# Altium schematic sheet KeyBoard.SchDoc
size A4
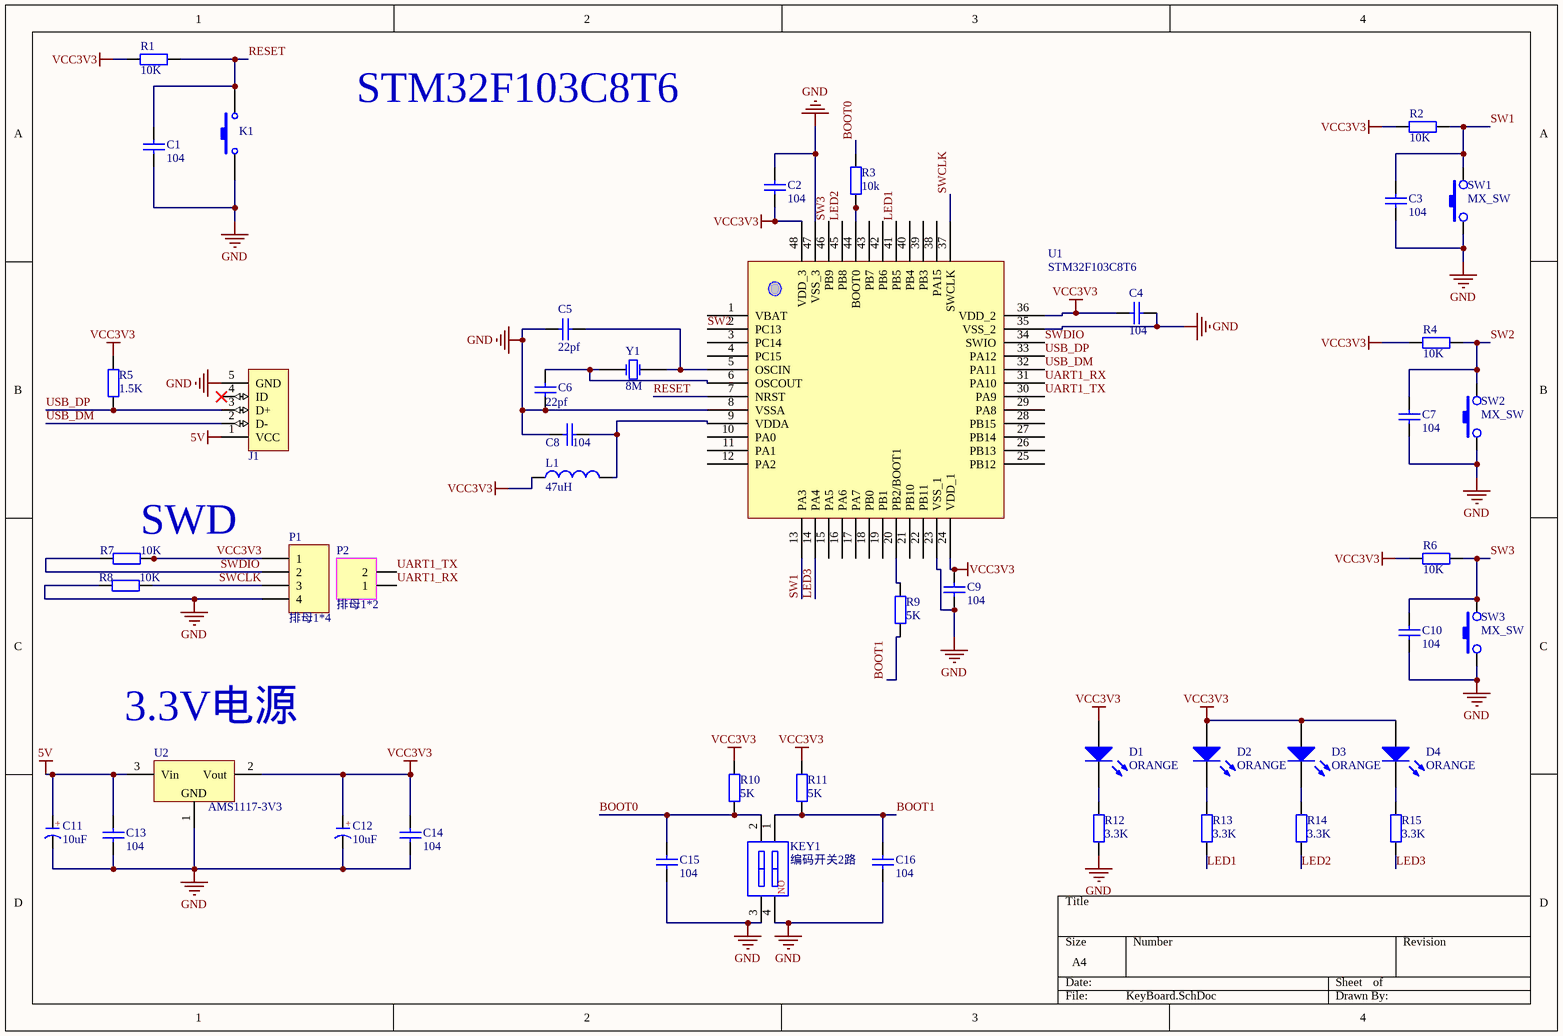
[diagram p0: KeyBoard.SchDoc]

## Parts
C1  104  [C 0805]
C2  104  [C 0805]
C3  104  [C 0805]
C4  104  [C 0805]
C5  22pf  [C 0805]
C6  22pf  [C 0805]
C7  104  [C 0805]
C8  104  [C 0805]
C9  104  [C 0805]
C10  104  [C 0805]
C11  10uF  [CD B(3528)]
C12  10uF  [CD B(3528)]
C13  104  [C 0805]
C14  104  [C 0805]
C15  104  [C 0805]
C16  104  [C 0805]
D1  ORANGE  [LED_0805]
D2  ORANGE  [LED_0805]
D3  ORANGE  [LED_0805]
D4  ORANGE  [LED_0805]
J1  Micro USB 2.0 PORT  [USB_MICRO]  (value not drawn)
K1  Key  [KEY 3.6*2.5 SMD]  (value not drawn)
KEY1  编码开关2路  [CSW1.27 SMD-2P]
L1  47uH  [L 0805]
P1  排母1*4  [HDR2.54-M-LI-4P]
P2  排母1*2  [HDR2.54-M-LI-2P]
R1  10K  [R 0805]
R2  10K  [R 0805]
R3  10k  [R 0805]
R4  10K  [R 0805]
R5  1.5K  [R 0805]
R6  10K  [R 0805]
R7  10K  [R 0805]
R8  10K  [R 0805]
R9  5K  [R 0805]
R10  5K  [R 0805]
R11  5K  [R 0805]
R12  3.3K  [R 0805]
R13  3.3K  [R 0805]
R14  3.3K  [R 0805]
R15  3.3K  [R 0805]
SW1  MX_SW  [MX_SW-4]
SW2  MX_SW  [MX_SW-4]
SW3  MX_SW  [MX_SW-4]
U1  STM32F103C8T6  [LQFP48]
U2  AMS1117-3V3  [SOT223_N]
Y1  8M  [XTAL-5032]

## Nets
5V: C11.1(A) C13.2 J1.1(VCC) U2.3(Vin)
GND: C1.1 C2.2 C3.1 C4.1 C5.2 C6.2 C7.1 C8.2 C9.1 C10.1 C11.2(K) C12.2(K) C13.1 C14.1 C15.1 C16.1 J1.5(GND) K1.1 KEY1.3 KEY1.4 P1.4 R8.2 R12.1 SW1.1 SW2.1 SW3.1 U1.8(VSSA) U1.23(VSS_1) U1.35(VSS_2) U1.47(VSS_3) U2.1(GND)
VCC3V3: C2.1 C4.2 C9.2 C12.1(A) C14.2 D1.1(A) D2.1(A) D3.1(A) D4.1(A) L1.1 P1.1 R1.1 R2.1 R4.1 R5.2 R6.1 R7.1 R10.2 R11.2 U1.24(VDD_1) U1.36(VDD_2) U1.48(VDD_3) U2.2(Vout)
BOOT0: C15.2 KEY1.2 R3.2 R10.1
BOOT1: C16.2 KEY1.1 R9.1 R11.1
LED1: R13.1 U1.41(PB5)
LED2: R14.1 U1.45(PB8)
LED3: R15.1 U1.14(PA4)
RESET: C1.2 K1.2 R1.2 U1.7(NRST)
SW1: C3.2 R2.2 SW1.2 U1.13(PA3)
SW2: C7.2 R4.2 SW2.2 U1.2(PC13)
SW3: C10.2 R6.2 SW3.2 U1.46(PB9)
SWCLK: P1.3 R8.1 U1.37(SWCLK)
SWDIO: P1.2 R7.2 U1.34(SWIO)
UART1_RX: P2.1 U1.31(PA10)
UART1_TX: P2.2 U1.30(PA9)
USB_DM: J1.2(D-) U1.32(PA11)
USB_DP: J1.3(D+) R5.1 U1.33(PA12)
NetC5_1: C5.1 U1.5(OSCIN) Y1.2(OSC2)
NetC6_1: C6.1 U1.6(OSCOUT) Y1.1(OSC1)
NetC8_1: C8.1 L1.2 U1.9(VDDA)
NetD1_2: D1.2(K) R12.2
NetD2_2: D2.2(K) R13.2
NetD3_2: D3.2(K) R14.2
NetD4_2: D4.2(K) R15.2
NetR3_1: R3.1 U1.44(BOOT0)
NetR9_2: R9.2 U1.20(PB2/BOOT1)

Not connected (* = marked no-connect by the designer): J1 4(ID)*; U1 1(VBAT) 3(PC14) 4(PC15) 10(PA0) 11(PA1) 12(PA2) 15(PA5) 16(PA6) 17(PA7) 18(PB0) 19(PB1) 21(PB10) 22(PB11) 25(PB12) 26(PB13) 27(PB14) 28(PB15) 29(PA8) 38(PA15) 39(PB3) 40(PB4) 42(PB6) 43(PB7)

## Notes on the sheet
- STM32F103C8T6
- (near R7) SWD
- (near U2) 3.3V电源
- (in symbol 编码开关2路) NO
- (in symbol 贴片钽电容) +

## Library data of the parts
C1-C10 C13-C16 = Cap: 无极性电容
C11 C12 = 贴片钽电容
D1-D4 = LED: 发光二极管
J1 = Micro USB 2.0 PORT: Micro USB 2.0 插座
K1 = Key: 按键
L1 = Inductor: 电感
R1-R15 = Resistor: 电阻
SW1-SW3 = MX_SW-4: with Fixation pins  1-Pole
U1 = STM32F103C8T6: Micro controller
U2 = AMS1117: 三端稳压芯片; BOM名称: 稳压芯片; 版权归属: 源创客; 学习资源: www.ooocke.com
Y1 = XTAL: 晶振